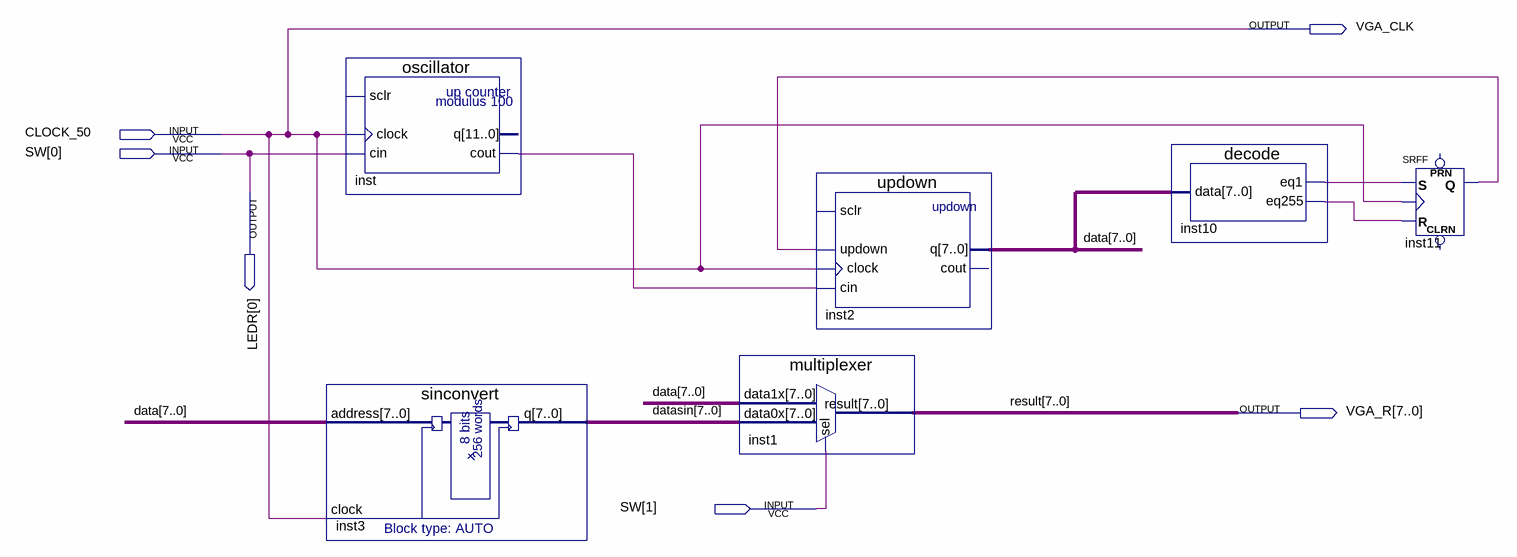
[diagram p0: schematic sheet]
// Quartus schematic TopLevel.bdf as structural Verilog: 6 symbols, 6 pins
module TopLevel (
  input  CLOCK_50,
  input  [1:0] SW,
  output VGA_CLK,
  output [0:0] LEDR,
  output [7:0] VGA_R
);

  wire inst10_eq1, inst10_eq255, inst11_q, inst_cout;
  wire [7:0] data, datasin;

  oscillator inst (.clock(CLOCK_50), .cin(SW[0]), .cout(inst_cout));  // open: sclr, q
  sinconvert inst3 (.address(data), .clock(CLOCK_50), .q(datasin));
  multiplexer inst1 (.data1x(data), .data0x(datasin), .sel(SW[1]), .result(VGA_R));
  updown inst2 (.updown(inst11_q), .clock(CLOCK_50), .cin(inst_cout), .q(data));  // open: sclr, cout
  decode inst10 (.data(data), .eq1(inst10_eq1), .eq255(inst10_eq255));
  SRFF inst11 (.S(inst10_eq1), .R(inst10_eq255), .CLK(CLOCK_50), .Q(inst11_q));  // open: PRN, CLRN

  assign LEDR[0] = SW[0];
  assign VGA_CLK = CLOCK_50;

  // Other names for the same wires on the sheet: result[7:0] = VGA_R
endmodule
